# Altium project Window_shades.PrjPcb
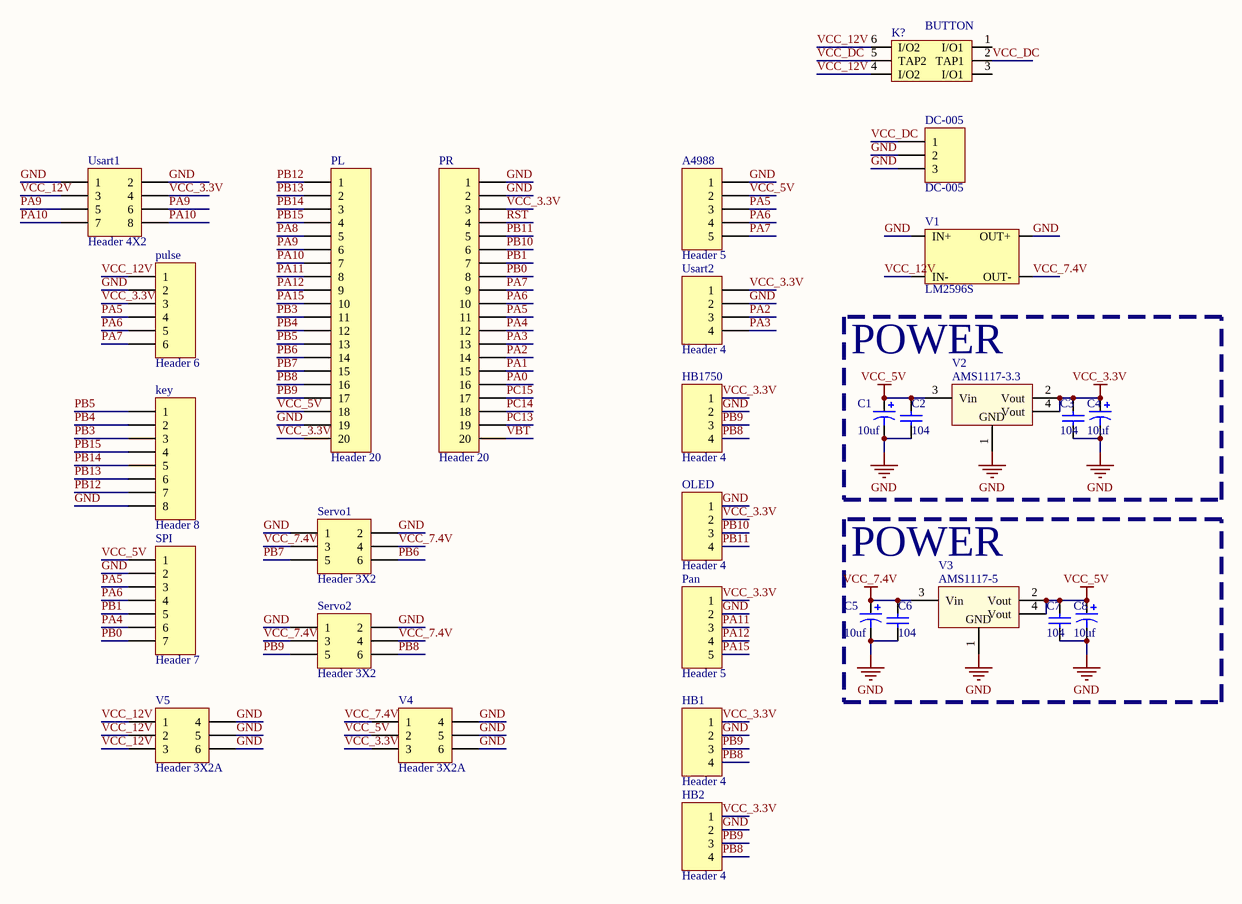
[diagram p0: Window_shades.SchDoc]
1 sheet, 30 parts. Net scope: global (net labels, ports and power ports of the same name join across sheets).
Board file: Window_shad_IIs.PcbDoc

## Sheet Window_shades.SchDoc
size A3

### Parts
A4988  Header 5  [HDR1X5]
C1  value 10uf  [C1206]  (hidden comment: Cap Pol3)
C2  value 104  [1608[0603]]  (hidden comment: Cap Semi)
C3  value 104  [1608[0603]]  (hidden comment: Cap Semi)
C4  value 10uf  [C1206]  (hidden comment: Cap Pol3)
C5  value 10uf  [C1206]  (hidden comment: Cap Pol3)
C6  value 104  [1608[0603]]  (hidden comment: Cap Semi)
C7  value 104  [1608[0603]]  (hidden comment: Cap Semi)
C8  value 10uf  [C1206]  (hidden comment: Cap Pol3)
DC-005  DC-005  [DC12V]
HB1  Header 4  [HDR1X4]
HB2  Header 4  [HDR1X4]
HB1750  Header 4  [HDR1X4]
K?  BUTTON  [Latching_switch]
key  Header 8  [HDR1X8]
OLED  Header 4  [HDR1X4]
Pan  Header 5  [HDR1X5]
PL  Header 20  [HDR1X20]
PR  Header 20  [HDR1X20]
pulse  Header 6  [HDR1X6]
Servo1  Header 3X2  [HDR2X3]
Servo2  Header 3X2  [HDR2X3]
SPI  Header 7  [HDR1X7]
Usart1  Header 4X2  [HDR2X4]
Usart2  Header 4  [HDR1X4]
V1  LM2596S  [MP1584EN]
V2  AMS1117-3.3  [SOT-223(AMS1117-3.3)]
V3  AMS1117-5  [SOT-223(AMS1117-3.3)]
V4  Header 3X2A  [HDR2X3_CEN]
V5  Header 3X2A  [HDR2X3_CEN]

### Blocks framed on the sheet
POWER: C1-C4 V2
POWER: C5-C8 V3

### Nets
GND: A4988.1 C1.2 C2.1 C3.1 C4.2 C5.2 C6.1 C7.1 C8.2 DC-005.2 DC-005.3 HB1.2 HB2.2 HB1750.2 key.8 OLED.1 Pan.2 PL.19 PR.1 PR.2 pulse.2 Servo1.1 Servo1.2 Servo2.1 Servo2.2 SPI.2 Usart1.1 Usart1.2 Usart2.2 V1.1(IN+) V1.3(OUT+) V2.1(GND) V3.1(GND) V4.4 V4.5 V4.6 V5.4 V5.5 V5.6
VCC_3.3V: C3.2 C4.1 HB1.1 HB2.1 HB1750.1 OLED.2 Pan.1 PL.20 PR.3 pulse.3 Usart1.4 Usart2.1 V2.2(Vout) V2.4(Vout) V4.3
VCC_5V: A4988.2 C1.1 C2.2 C7.2 C8.1 PL.18 SPI.1 V2.3(Vin) V3.2(Vout) V3.4(Vout) V4.2
VCC_7.4V: C5.1 C6.2 Servo1.3 Servo1.4 Servo2.3 Servo2.4 V1.4(OUT-) V3.3(Vin) V4.1
PA0: PR.16
PA1: PR.15
PA2: PR.14 Usart2.3
PA3: PR.13 Usart2.4
PA4: PR.12 SPI.6
PA5: A4988.3 PR.11 pulse.4 SPI.3
PA6: A4988.4 PR.10 pulse.5 SPI.4
PA7: A4988.5 PR.9 pulse.6
PA8: PL.5
PA9: PL.6 Usart1.5 Usart1.6
PA10: PL.7 Usart1.7 Usart1.8
PA11: Pan.3 PL.8
PA12: Pan.4 PL.9
PA15: Pan.5 PL.10
PB0: PR.8 SPI.7
PB1: PR.7 SPI.5
PB3: key.3 PL.11
PB4: key.2 PL.12
PB5: key.1 PL.13
PB6: PL.14 Servo1.6
PB7: PL.15 Servo1.5
PB8: HB1.4 HB2.4 HB1750.4 PL.16 Servo2.6
PB9: HB1.3 HB2.3 HB1750.3 PL.17 Servo2.5
PB10: OLED.3 PR.6
PB11: OLED.4 PR.5
PB12: key.7 PL.1
PB13: key.6 PL.2
PB14: key.5 PL.3
PB15: key.4 PL.4
PC13: PR.19
PC14: PR.18
PC15: PR.17
RST: PR.4
VBT: PR.20
VCC_12V: K?.4(I/O2) K?.6(I/O2) pulse.1 Usart1.3 V1.2(IN-) V5.1 V5.2 V5.3
VCC_DC: DC-005.1 K?.2(TAP1) K?.5(TAP2)

Not connected (* = marked no-connect by the designer): K? 1(I/O1) 3(I/O1)

### Library data of the parts
A4988 Pan = Header 5: Header, 5-Pin; LatestRevisionDate: 17-Jul-2002; LatestRevisionNote: Re-released for DXP Platform.; Publisher: Altium Limited
C1 C4 C5 C8 = Cap Pol3: Polarized Capacitor (Surface Mount); Published: 8-Jun-2000; LatestRevisionDate: 29-May-2009; LatestRevisionNote: IPC-7351 Footprint Added.; PackageReference: C0805; Publisher: Altium Limited; PackageDescription: Chip Capacitor
C2 C3 C6 C7 = Cap Semi: Capacitor (Semiconductor SIM Model); Published: 8-Jun-2000; LatestRevisionDate: 29-May-2009; LatestRevisionNote: IPC-7351 Footprint Added.; PackageReference: C1206; Publisher: Altium Limited; PackageDescription: Chip Capacitor
DC-005 = Header 3: Header, 3-Pin; LatestRevisionDate: 17-Jul-2002; LatestRevisionNote: Re-released for DXP Platform.; Publisher: Altium Limited
HB1 HB2 HB1750 OLED Usart2 = Header 4: Header, 4-Pin; LatestRevisionDate: 17-Jul-2002; LatestRevisionNote: Re-released for DXP Platform.; Publisher: Altium Limited
K? = KEY-6
key = Header 8: Header, 8-Pin; LatestRevisionDate: 17-Jul-2002; LatestRevisionNote: Re-released for DXP Platform.; Publisher: Altium Limited
PL PR = Header 20: Header, 20-Pin; LatestRevisionDate: 17-Jul-2002; LatestRevisionNote: Re-released for DXP Platform.; Publisher: Altium Limited
pulse = Header 6: Header, 6-Pin; LatestRevisionDate: 17-Jul-2002; LatestRevisionNote: Re-released for DXP Platform.; Publisher: Altium Limited
Servo1 Servo2 = Header 3X2: Header, 3-Pin, Dual row; LatestRevisionDate: 17-Jul-2002; LatestRevisionNote: Re-released for DXP Platform.; Publisher: Altium Limited
SPI = Header 7: Header, 7-Pin; LatestRevisionDate: 17-Jul-2002; LatestRevisionNote: Re-released for DXP Platform.; Publisher: Altium Limited
Usart1 = Header 4X2: Header, 4-Pin, Dual row; LatestRevisionDate: 17-Jul-2002; LatestRevisionNote: Re-released for DXP Platform.; Publisher: Altium Limited
V3 = AMS1117-3.3
V4 V5 = Header 3X2A: Header, 3-Pin, Dual row; LatestRevisionDate: 17-Jul-2002; LatestRevisionNote: Re-released for DXP Platform.; Publisher: Altium Limited